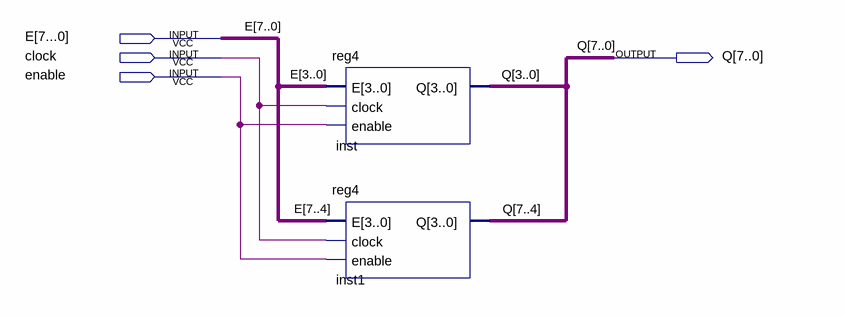
[diagram p0: schematic sheet]
// Quartus schematic reg8.bdf as structural Verilog: 2 symbols, 4 pins
module reg8 (
  input  \E[7...0] ,
  input  clock,
  input  enable,
  output [7:0] Q
);

  wire [7:0] E;

  reg4 inst (.E(E[3:0]), .clock(clock), .enable(enable), .Q(Q[3:0]));
  reg4 inst1 (.E(E[7:4]), .clock(clock), .enable(enable), .Q(Q[7:4]));
endmodule
